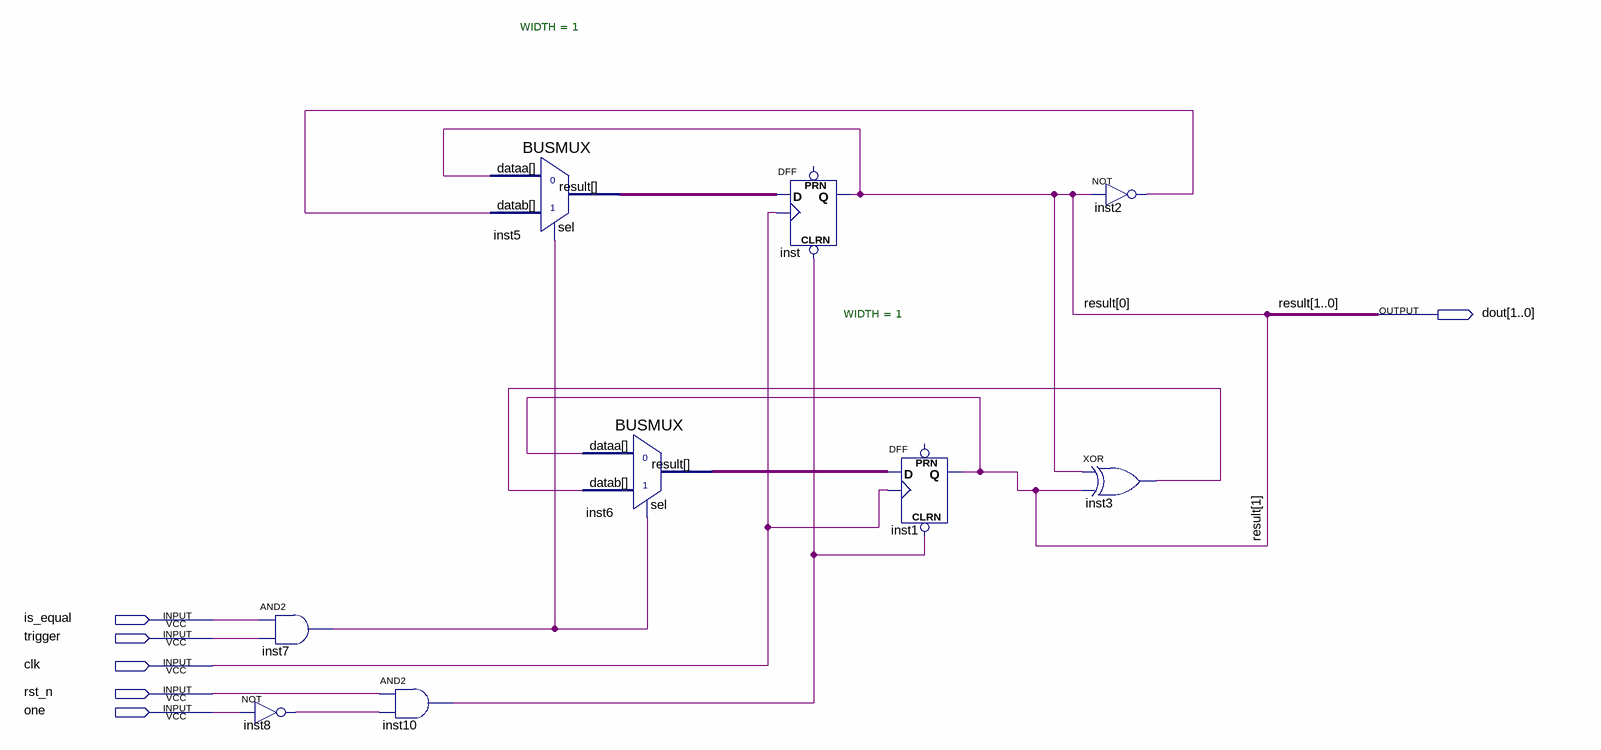
[diagram p0: schematic sheet]
// Quartus schematic counter2.bdf as structural Verilog: 9 symbols, 6 pins
module counter2 (
  input  is_equal,
  input  trigger,
  input  clk,
  input  rst_n,
  input  one,
  output [1:0] dout
);

  wire inst2_out, inst3_out, inst5_result, inst6_result, inst7_out, inst8_out, inst10_out;

  and inst7 (inst7_out, is_equal, trigger);
  not inst8 (inst8_out, one);
  and inst10 (inst10_out, rst_n, inst8_out);
  BUSMUX #(.WIDTH(1)) inst5 (.datab(inst2_out), .sel(inst7_out), .dataa(dout[0]), .result(inst5_result));
  BUSMUX #(.WIDTH(1)) inst6 (.datab(inst3_out), .sel(inst7_out), .dataa(dout[1]), .result(inst6_result));
  DFF inst (.CLRN(inst10_out), .CLK(clk), .D(inst5_result), .Q(dout[0]));  // open: PRN
  DFF inst1 (.CLRN(inst10_out), .CLK(clk), .D(inst6_result), .Q(dout[1]));  // open: PRN
  not inst2 (inst2_out, dout[0]);
  xor inst3 (inst3_out, dout[0], dout[1]);

  // Other names for the same wires on the sheet: result[1:0] = dout
endmodule
